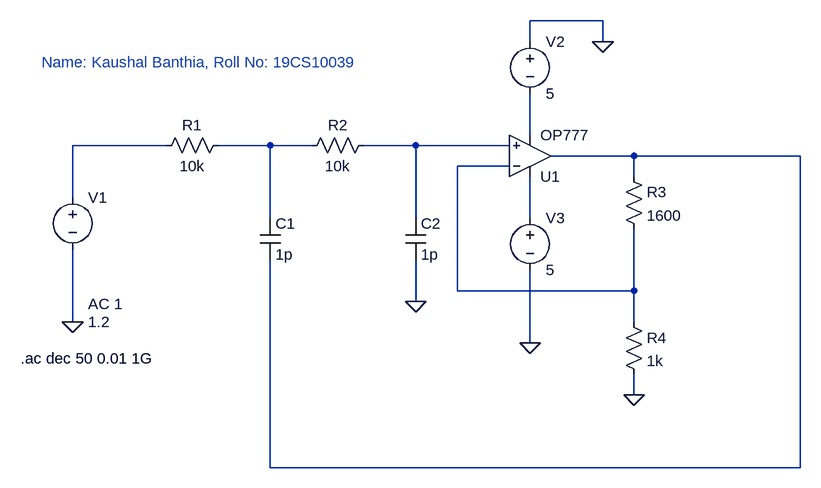
[diagram p0: schematic Active Low Pass Filter.asc]
Active Low Pass Filter.asc, the LTspice schematic file:
Version 4
SHEET 1 1124 680
WIRE 816 -256 704 -256
WIRE 704 -224 704 -256
WIRE 816 -224 816 -256
WIRE 704 -80 704 -144
WIRE 144 -64 0 -64
WIRE 304 -64 224 -64
WIRE 368 -64 304 -64
WIRE 528 -64 448 -64
WIRE 672 -64 528 -64
WIRE 864 -48 736 -48
WIRE 1120 -48 864 -48
WIRE 672 -32 592 -32
WIRE 864 -16 864 -48
WIRE 0 16 0 -64
WIRE 304 48 304 -64
WIRE 528 48 528 -64
WIRE 704 48 704 -16
WIRE 592 160 592 -32
WIRE 864 160 864 64
WIRE 864 160 592 160
WIRE 528 176 528 112
WIRE 0 208 0 96
WIRE 864 208 864 160
WIRE 704 240 704 128
WIRE 864 320 864 288
WIRE 304 432 304 112
WIRE 1120 432 1120 -48
WIRE 1120 432 304 432
FLAG 0 208 0
FLAG 528 176 0
FLAG 864 320 0
FLAG 816 -224 0
FLAG 704 240 0
SYMBOL voltage 0 0 R0
WINDOW 3 24 208 Left 2
WINDOW 123 24 180 Left 2
WINDOW 39 0 0 Left 0
SYMATTR Value 1.2
SYMATTR Value2 AC 1
SYMATTR InstName V1
SYMBOL res 240 -80 R90
WINDOW 0 0 56 VBottom 2
WINDOW 3 32 56 VTop 2
SYMATTR InstName R1
SYMATTR Value 10k
SYMBOL res 464 -80 R90
WINDOW 0 0 56 VBottom 2
WINDOW 3 32 56 VTop 2
SYMATTR InstName R2
SYMATTR Value 10k
SYMBOL cap 288 48 R0
SYMATTR InstName C1
SYMATTR Value 1p
SYMBOL cap 512 48 R0
SYMATTR InstName C2
SYMATTR Value 1p
SYMBOL OpAmps\\OP777 704 16 M180
SYMATTR InstName U1
SYMBOL voltage 704 -240 R0
WINDOW 123 0 0 Left 0
WINDOW 39 0 0 Left 0
SYMATTR InstName V2
SYMATTR Value 5
SYMBOL voltage 704 32 R0
WINDOW 123 0 0 Left 0
WINDOW 39 0 0 Left 0
SYMATTR InstName V3
SYMATTR Value 5
SYMBOL res 848 -32 R0
SYMATTR InstName R3
SYMATTR Value 1600
SYMBOL res 848 192 R0
SYMATTR InstName R4
SYMATTR Value 1k
TEXT -80 264 Left 2 !.ac dec 50 0.01 1G
TEXT -48 -192 Left 2 ;Name: Kaushal Banthia, Roll No: 19CS10039

The netlist it stands for:
* Active Low Pass Filter.asc
V1 N002 0 1.2 AC 1
R1 N003 N002 10k
R2 N004 N003 10k
C1 N003 N005 1p
C2 N004 0 1p
XU1 N004 N006 N007 N001 N005 OP777  ; pins In+ In- V+ V- OUT
V2 0 N001 5
V3 N007 0 5
R3 N005 N006 1600
R4 N006 0 1k
.ac dec 50 0.01 1G
* Name: Kaushal Banthia, Roll No: 19CS10039
.lib ADI.lib
.backanno
.end